# Altium schematic sheet light_clock.SchDoc
size A4
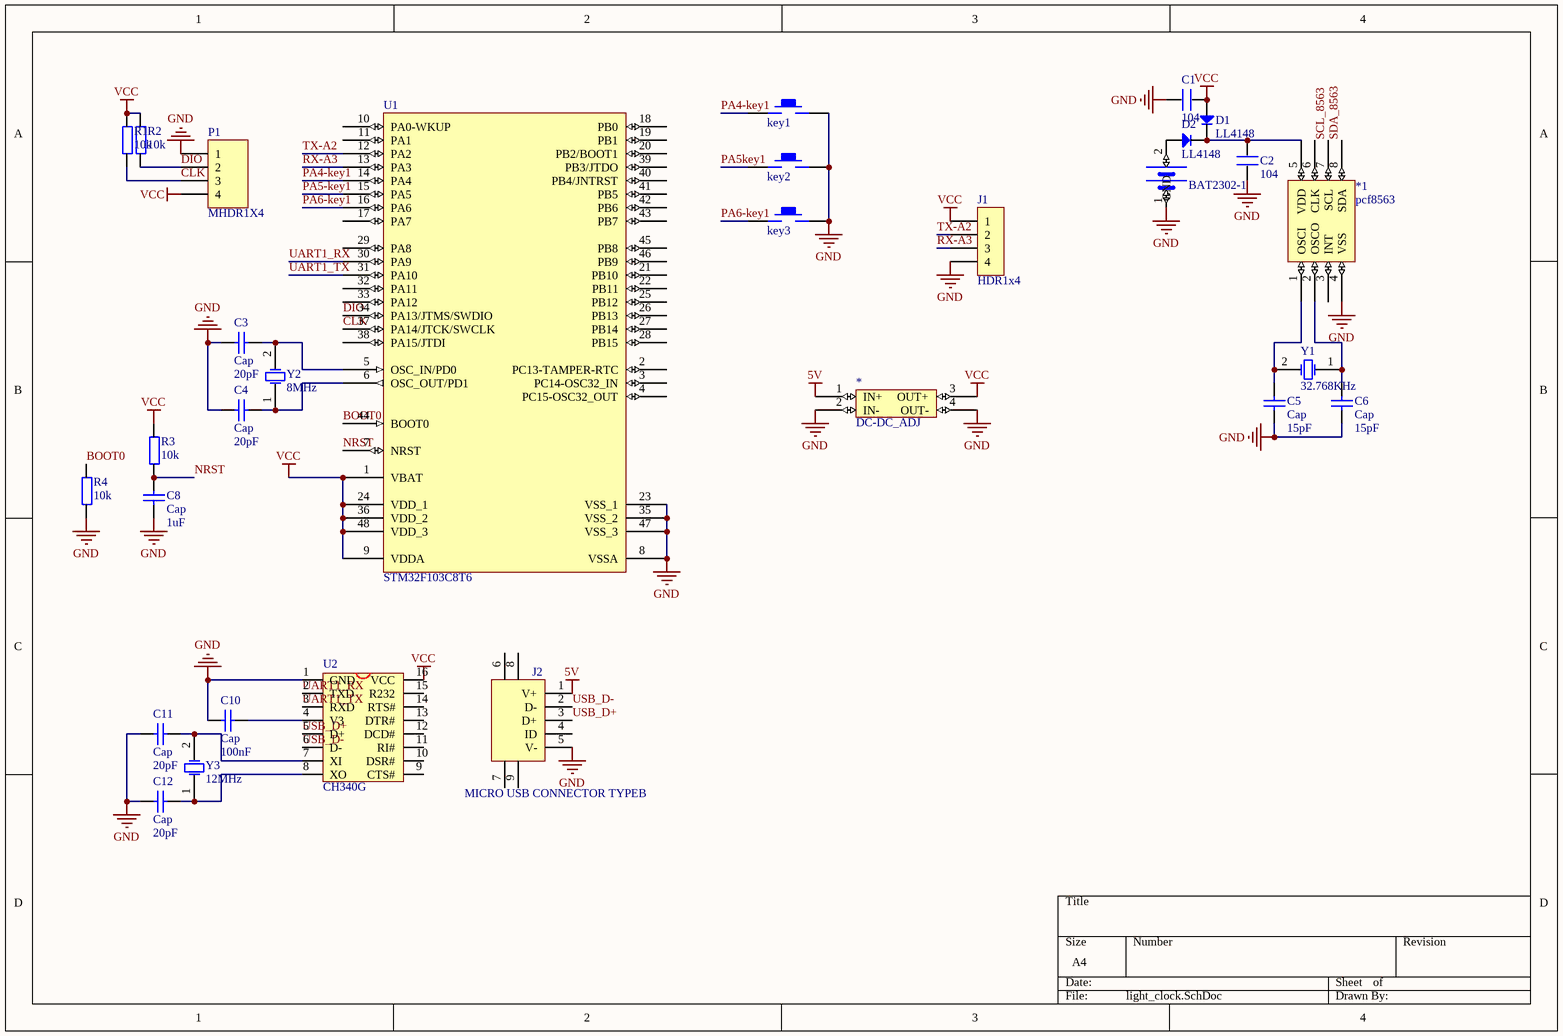
[diagram p0: light_clock.SchDoc]

## Parts
*  DC-DC_ADJ  [DC-DC_ADJ]
*1  pcf8563  [SOP-8]
BAT2302-1  BAT2302  [CR2302]  (value not drawn)
C1  104  [0603]
C2  104  [0603]
C3  Cap  value 20pF  [0603]
C4  Cap  value 20pF  [0603]
C5  Cap  value 15pF  [0603]
C6  Cap  value 15pF  [0603]
C8  Cap  value 1uF  [0603]
C10  Cap  value 100nF  [0603]
C11  Cap  value 20pF  [0603]
C12  Cap  value 20pF  [0603]
D1  LL4148  [LL4148]
D2  LL4148  [LL4148]
J1  HDR1x4  [PIN-4-2.0-0.8]
J2  MICRO USB CONNECTOR TYPEB  [MICRO USB MK5P]
key1  KEY_M  [KEY_weidong]  (value not drawn)
key2  KEY_M  [KEY_weidong]  (value not drawn)
key3  KEY_M  [KEY_weidong]  (value not drawn)
P1  MHDR1X4  [HDR1X4]
R1  10k  [0603]
R2  10k  [0603]
R3  10k  [0603]
R4  10k  [0603]
U1  STM32F103C8T6  [STM-LQFP48_N]
U2  CH340G  [SOP16M]
Y1  32.768KHz  [PIN-2-2.0-0.8]
Y2  8MHz  [XTAL_US]
Y3  12MHz  [PIN-2-2.0-0.8]

## Nets
5V: *.1(IN+) J2.1(V+)
GND: *.2(IN-) *.4(OUT-) *1.4(VSS) BAT2302-1.1(VCC) C1.1 C2.1 C3.1 C4.1 C5.1 C6.1 C8.1 C10.2 C11.1 C12.1 J1.4 J2.5(V-) key1.2 key2.2 key3.2 P1.1 R4.1 U1.8(VSSA) U1.23(VSS_1) U1.35(VSS_2) U1.47(VSS_3) U2.1(GND)
VCC: *.3(OUT+) C1.2 D1.2 J1.1 P1.4 R1.2 R2.2 R3.2 U1.1(VBAT) U1.9(VDDA) U1.24(VDD_1) U1.36(VDD_2) U1.48(VDD_3) U2.16(VCC)
BOOT0: R4.2 U1.44(BOOT0)
CLK: P1.3 R1.1 U1.37(PA14/JTCK/SWCLK)
DIO: P1.2 R2.1 U1.34(PA13/JTMS/SWDIO)
NRST: C8.2 R3.1 U1.7(NRST)
PA4-key1: key1.1 U1.14(PA4)
PA5-key1: U1.15(PA5)
PA5key1: key2.1
PA6-key1: key3.1 U1.16(PA6)
RX-A3: J1.3 U1.13(PA3)
SCL_8563: *1.7(SCL)
SDA_8563: *1.8(SDA)
TX-A2: J1.2 U1.12(PA2)
UART1_RX: U1.30(PA9) U2.2(TXD)
UART1_TX: U1.31(PA10) U2.3(RXD)
USB_D+: J2.3(D+) U2.5(D+)
USB_D-: J2.2(D-) U2.6(D-)
Net*1_1: *1.1(OSCI) C5.2 Y1.2(OSC2)
Net*1_2: *1.2(OSCO) C6.2 Y1.1(OSC1)
Net*1_5: *1.5(VDD) C2.2 D1.1 D2.1
NetBAT2302-1_2: BAT2302-1.2(GND) D2.2
NetC3_2: C3.2 U1.5(OSC_IN/PD0) Y2.2(OSC2)
NetC4_2: C4.2 U1.6(OSC_OUT/PD1) Y2.1(OSC1)
NetC10_1: C10.1 U2.4(V3)
NetC11_2: C11.2 U2.7(XI) Y3.2(OSC2)
NetC12_2: C12.2 U2.8(XO) Y3.1(OSC1)

Not connected (* = marked no-connect by the designer): *1 3(INT) 6(CLK); J2 4(ID) 6 7 8 9; U1 2(PC13-TAMPER-RTC) 3(PC14-OSC32_IN) 4(PC15-OSC32_OUT) 10(PA0-WKUP) 11(PA1) 17(PA7) 18(PB0) 19(PB1) 20(PB2/BOOT1) 21(PB10) 22(PB11) 25(PB12) 26(PB13) 27(PB14) 28(PB15) 29(PA8) 32(PA11) 33(PA12) 38(PA15/JTDI) 39(PB3/JTDO) 40(PB4/JNTRST) 41(PB5) 42(PB6) 43(PB7) 45(PB8) 46(PB9); U2 9(CTS#) 10(DSR#) 11(RI#) 12(DCD#) 13(DTR#) 14(RTS#) 15(R232)

## Library data of the parts
C1 C2 = C
C3-C6 C8 C10-C12 = Cap: Capacitor; Published: 8-Jun-2000; LatestRevisionDate: 17-Jul-2002; LatestRevisionNote: Re-released for DXP Platform.; PackageReference: RAD-0.3; Publisher: Altium Limited; PackageDescription: Radial Cap, Thru-Hole; 2 Leads; 0.3 in Pin Spacing
J1 = HDR1x4: Connector
J2 = MICRO USB CONNECTOR TYPEB: USB Connector
P1 = MHDR1X4: Header, 4-Pin; LatestRevisionDate: 17-Jul-2002; LatestRevisionNote: Re-released for DXP Platform.; Publisher: Altium Limited
R1-R4 = R
U1 = STM32F103C8T6: STM32 ARM-based 32-bit MCU with 64 Kbytes Flash, 48-pin LQFP, Industrial Temperature; Published: *; DatasheetVersion: *; PackageVersion: *; PackageReference: *; Publisher: *; PackageDescription: *; ComponentLink1Description: *; ComponentLink1URL: *; ComponentLink2Description: *; ComponentLink2URL: *
U2 = CH340G: USB2UART
Y1-Y3 = XTAL: Crystal Oscillator; Published: 8-Jun-2000; LatestRevisionDate: 17-Jul-2002; LatestRevisionNote: Re-released for DXP Platform.; Publisher: Altium Limited